# EAGLE design Arm_V4 (EAGLE 9.6.2)
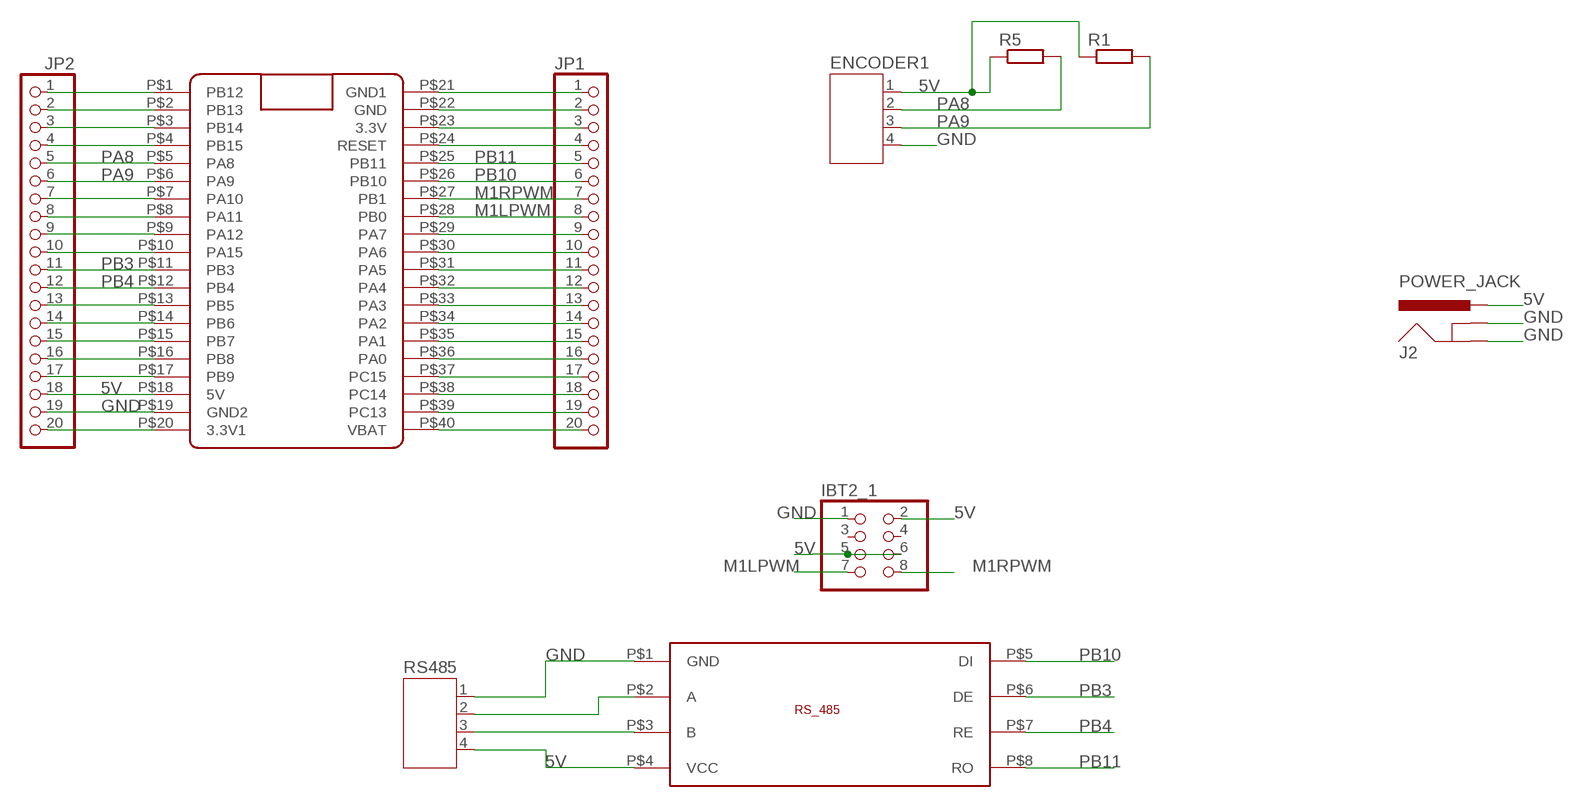
[diagram p0: schematic, sheet 1]

## Parts
ENCODER1  JST-PH4  [JST-PH4]
IBT2_1  PINHD-2X4  [2X04]
J2  POWER_JACK  [POWER_JACK]
JP1  PINHD-1X20  [1X20]
JP2  PINHD-1X20  [1X20]
R1  R-EU_0207/10  [0207/10]
R5  R-EU_0207/10  [0207/10]
RS485  JST-PH4  [JST-PH4]
U$1  BLUE_PILL  [BLUE_PILL]
U$2  RS_485PCB  [RSS485PCB]

## Nets
5V: ENCODER1.1 IBT2_1.2 IBT2_1.5 IBT2_1.6 J2.PWR JP2.18 R1.1 R5.1 RS485.4 U$1.P$18(5V) U$2.P$4(VCC)
GND: ENCODER1.4 IBT2_1.1 J2.GNDBREAK JP2.19 RS485.1 U$1.P$19(GND2) U$2.P$1(GND)
M1LPWM: IBT2_1.7 JP1.8 U$1.P$28(PB0)
M1RPWM: IBT2_1.8 JP1.7 U$1.P$27(PB1)
N$1: JP1.1 U$1.P$21(GND1)
N$2: JP1.2 U$1.P$22(GND)
N$3: JP1.3 U$1.P$23(3.3V)
N$4: JP1.4 U$1.P$24(RESET)
N$5: JP1.9 U$1.P$29(PA7)
N$6: J2.GND
N$7: JP1.10 U$1.P$30(PA6)
N$8: JP2.14 U$1.P$14(PB6)
N$9: JP2.15 U$1.P$15(PB7)
N$10: RS485.2 U$2.P$2(A)
N$11: JP1.11 U$1.P$31(PA5)
N$12: JP1.12 U$1.P$32(PA4)
N$13: JP1.13 U$1.P$33(PA3)
N$14: JP1.14 U$1.P$34(PA2)
N$15: JP1.15 U$1.P$35(PA1)
N$16: JP1.16 U$1.P$36(PA0)
N$17: JP1.17 U$1.P$37(PC15)
N$18: JP1.18 U$1.P$38(PC14)
N$19: JP1.19 U$1.P$39(PC13)
N$20: JP1.20 U$1.P$40(VBAT)
N$21: JP2.1 U$1.P$1(PB12)
N$22: JP2.2 U$1.P$2(PB13)
N$23: JP2.3 U$1.P$3(PB14)
N$24: JP2.4 U$1.P$4(PB15)
N$25: RS485.3 U$2.P$3(B)
N$27: JP2.7 U$1.P$7(PA10)
N$28: JP2.8 U$1.P$8(PA11)
N$29: JP2.9 U$1.P$9(PA12)
N$30: JP2.10 U$1.P$10(PA15)
N$33: JP2.13 U$1.P$13(PB5)
N$36: JP2.16 U$1.P$16(PB8)
N$37: JP2.17 U$1.P$17(PB9)
N$40: JP2.20 U$1.P$20(3.3V1)
PA8: ENCODER1.2 JP2.5 R5.2 U$1.P$5(PA8)
PA9: ENCODER1.3 JP2.6 R1.2 U$1.P$6(PA9)
PB3: JP2.11 U$1.P$11(PB3) U$2.P$6(DE)
PB4: JP2.12 U$1.P$12(PB4) U$2.P$7(RE)
PB10: JP1.6 U$1.P$26(PB10) U$2.P$5(DI)
PB11: JP1.5 U$1.P$25(PB11) U$2.P$8(RO)
Unconnected: IBT2_1.3 IBT2_1.4

## Library data of the parts
ENCODER1 RS485 = jst-ph:JST-PH4
IBT2_1 = pinhead:PINHD-2X4: PIN HEADER
J2 = J-Generic-5.5mm-Barrel-Jack:POWER_JACK: Power Jack Connector This is the standard 5.5mm barrel jack for power. The PTH is the most common, proven, reliable, footprint. The Slot footprint only works if the mill layer is transmitted to the PCB fab house so be warned. Here are the connectors we sell at SparkFun: DC Barrel Power Jack/Connector <https://www.sparkfun.com/products/119> (PRT-00119) DC Barrel Power Jack/Connector (SMD) <https://www.sparkfun.com/products/12748> (PRT-12748) DC Barrel Jack Adapter - Breadboard Compatible <https://www.sparkfun.com/products/10811> (PRT-10811) It is used on this SparkFun product (and many, many others): SparkFun RedBoard - Programmed with Arduino <https://www.sparkfun.com/products/12757> (DEV-12757) Also, if you need a mating power supply or connector, please check these out: Wall Adapter Power Supply - 9VDC 650mA <https://www.sparkfun.com/products/298> (TOL-00298) DC Barrel Jack Adapter - Male <https://www.sparkfun.com/products/10287> (PRT-10287); DPN: CP-202A-ND; MPN: PJ-202A
JP1 JP2 = pinhead:PINHD-1X20: PIN HEADER
R1 R5 = rcl:R-EU_: RESISTOR, European symbol; SPICEPREFIX: R
U$1 = BluePill:BLUE_PILL
U$2 = RS_485PCB:RS_485PCB

## Net classes
0 default: width 1.016 mm, clearance 0.508 mm

## Board
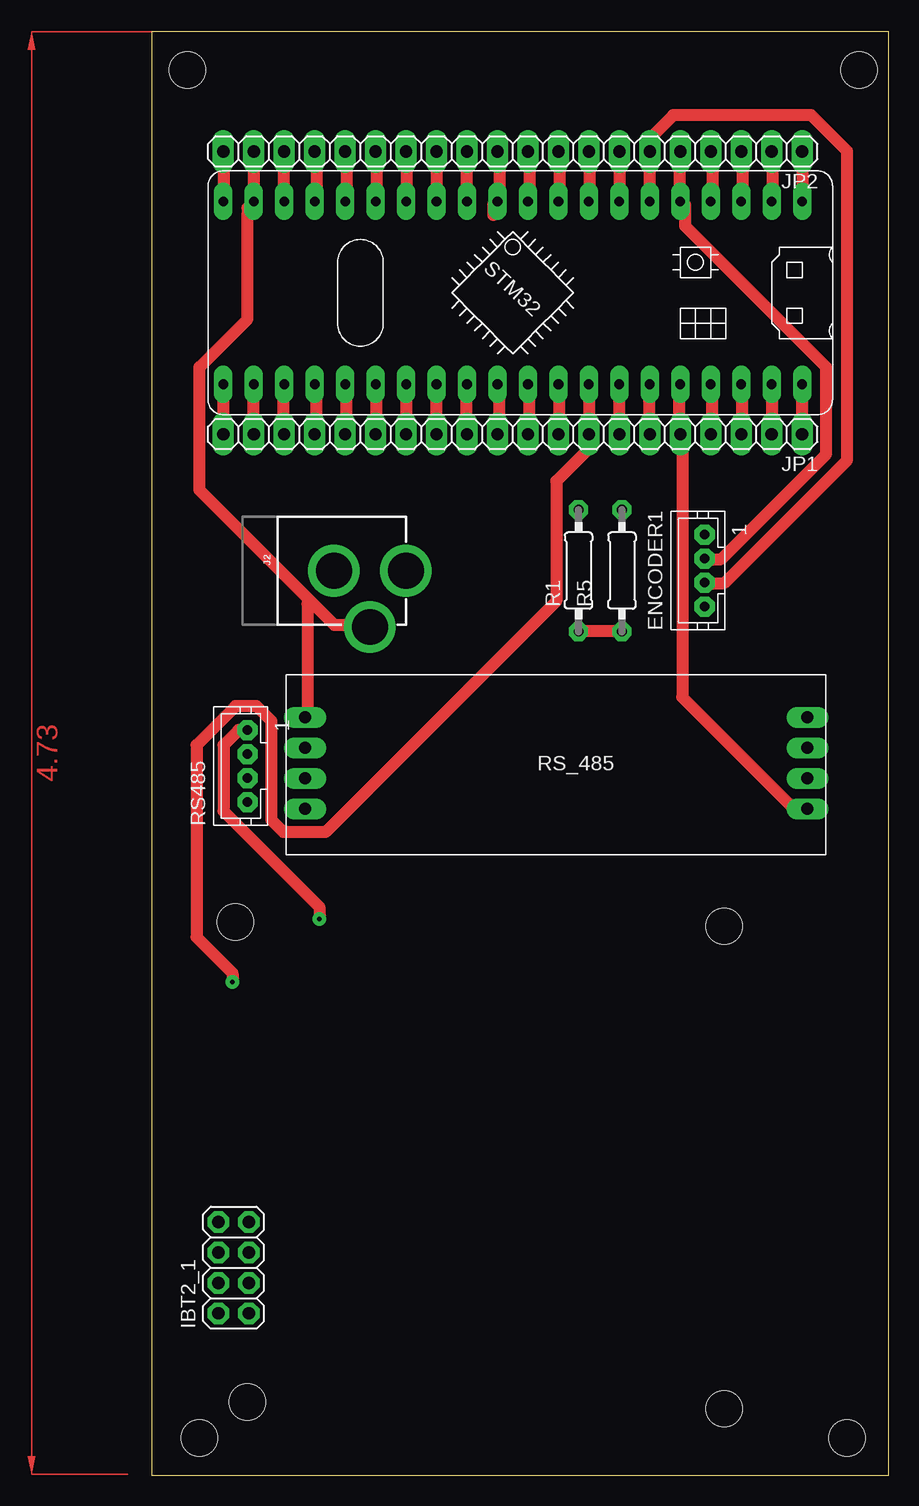
[diagram p1: board, top side]
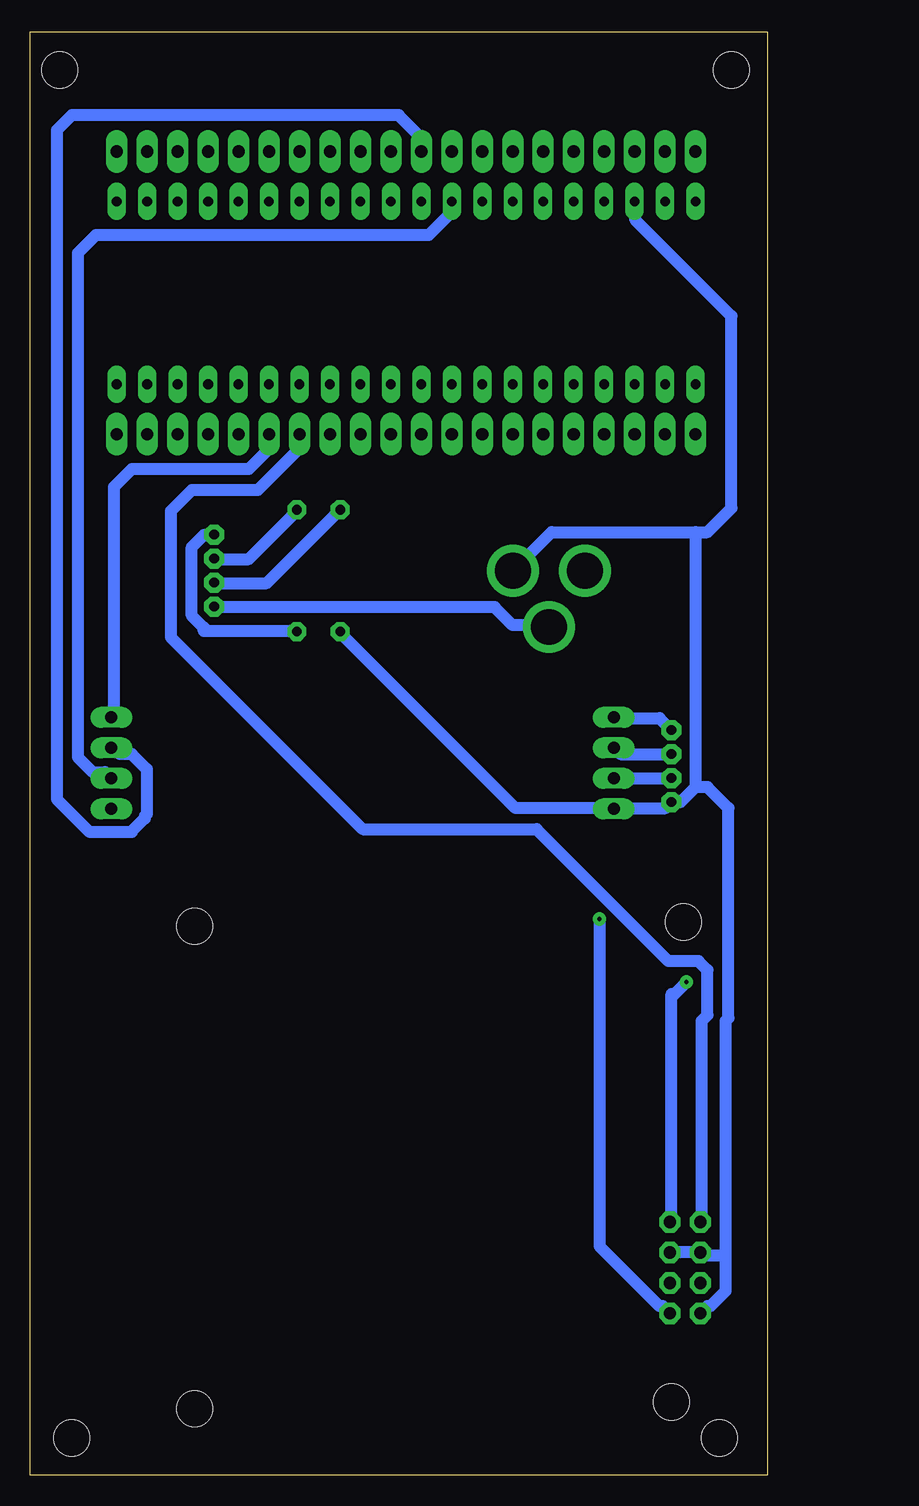
[diagram p2: board, bottom side, seen from below]

Size 61.48 x 120.29 mm. Coordinates in mm from the lower left corner, seen from the top.
Outline: 0,0 61.48,0 61.48,120.29 0,120.29 0,0
Copper layers (1*16): Top 0.035mm / dielectric 1.5mm / Bottom 0.035mm
Design rules "default *": minimum track width 40mil, minimum drill 0.35mm, track to track 20mil, track to pad 6mil, pad to pad 6mil, via to via 6mil, smd to smd 6mil, copper to edge 40mil, drill to drill 6mil, minimum pad ring 15mil, minimum via ring 15mil, stop-mask expansion 4mil, vias tented up to drill 0mil, thermal gap 10mil
Holes 3 mm at 47.75,45.73 47.75,5.53 7,46.08 3,117.08 8,6.08 59,117.08 58,3.08 4,3.08
tRestrict: area 7.5,5.5 to 47.8,45.7; area 4,12.1 to 7,22.1

### Footprints (pad centres in the part's own frame; a part is rotated, then mirrored left to right if it is on the bottom)
JST-PH4 = drill 0.813 pad 1.676 octagon: 1 3,0; 2 1,0; 3 -1,0; 4 -3,0
2X04 = drill 1.016 octagon: 1 -3.81,-1.27; 2 -3.81,1.27; 3 -1.27,-1.27; 4 -1.27,1.27; 5 1.27,-1.27; 6 1.27,1.27; 7 3.81,-1.27; 8 3.81,1.27
POWER_JACK = drill 2.997 pad 4.318: GND 0,7.7; GNDBREAK 4.7,10.7; PWR 0,13.7
1X20 = drill 1.016 long: 1 -24.13,0; 2 -21.59,0; 3 -19.05,0; 4 -16.51,0; 5 -13.97,0; 6 -11.43,0; 7 -8.89,0; 8 -6.35,0; 9 -3.81,0; 10 -1.27,0; 11 1.27,0; 12 3.81,0; 13 6.35,0; 14 8.89,0; 15 11.43,0; 16 13.97,0; 17 16.51,0; 18 19.05,0; 19 21.59,0; 20 24.13,0
0207/10 = drill 0.813 octagon: 1 -5.08,0; 2 5.08,0
BLUE_PILL = drill 0.8 long: P$1 -7.62,15.24; P$2 -7.62,12.7; P$3 -7.62,10.16; P$4 -7.62,7.62; P$5 -7.62,5.08; P$6 -7.62,2.54; P$7 -7.62,0; P$8 -7.62,-2.54; P$9 -7.62,-5.08; P$10 -7.62,-7.62; P$11 -7.62,-10.16; P$12 -7.62,-12.7; P$13 -7.62,-15.24; P$14 -7.62,-17.78; P$15 -7.62,-20.32; P$16 -7.62,-22.86; P$17 -7.62,-25.4; P$18 -7.62,-27.94; P$19 -7.62,-30.48; P$20 -7.62,-33.02; P$21 7.62,15.24; P$22 7.62,12.7; P$23 7.62,10.16; P$24 7.62,7.62; P$25 7.62,5.08; P$26 7.62,2.54; P$27 7.62,0; P$28 7.62,-2.54; P$29 7.62,-5.08; P$30 7.62,-7.62; P$31 7.62,-10.16; P$32 7.62,-12.7; P$33 7.62,-15.24; P$34 7.62,-17.78; P$35 7.62,-20.32; P$36 7.62,-22.86; P$37 7.62,-25.4; P$38 7.62,-27.94; P$39 7.62,-30.48; P$40 7.62,-33.02
RSS485PCB = drill 1 long: P$1 1.57,11.43; P$2 1.57,8.89; P$3 1.57,6.35; P$4 1.57,3.81; P$5 43.45,11.43; P$6 43.45,8.89; P$7 43.45,6.35; P$8 43.45,3.81

### Placement (x,y rotation side)
ENCODER1  46.12,75.37 90 top
IBT2_1  6.85,17.28 90 top
J2  7.51,75.37 270 top
JP1  30.12,86.74 180 top
JP2  30.12,110.3 180 top
R1  35.61,75.37 90 top
R5  39.23,75.37 90 top
RS485  8,59.08 90 top
U$1  39.01,98.52 270 top
U$2  11.24,51.7 0 top

### Tracks (layer width: path | path; a pad name or v marks a point on that pad's centre or on a via)
5V
  Top 1.016: U$1.P$18 11,106.33 11,110.08 JP2.18 | R1.1 35.75,70.33 39,70.33 R5.1
  Bottom 1.016: 11,105.08 11,106.08 U$1.P$18 11,104.58 3,96.58 3,80.58 5,78.58 6,78.58 | ENCODER1.1 46.25,78.33 47,78.33 48,77.33 48,71.63 47,70.63 47,70.33 39.25,70.33 R5.1 | 3.5,18.33 3.5,15.33 4.75,14.08 5,14.08 5.5,13.58 IBT2_1.2 | 3.5,18.33 5.5,18.33 IBT2_1.6 6,18.58 8,18.58 IBT2_1.5 | 6,78.58 18,78.58 J2.PWR | 6,57.33 7.25,56.08 RS485.4 8.5,55.58 12.75,55.58 U$2.P$4 13.25,55.58 21,55.58 35.5,70.08 R1.1 | 6,78.58 6,57.33 | 3.5,18.33 3.5,37.83 3.25,38.08 3.25,55.58 5,57.33 6,57.33
GND  (via drill 0.35)
  Top 1.016: U$1.P$19 8.5,106.33 8.5,110.08 JP2.19 | 8,105.58 8.25,105.83 U$1.P$19 | v14,46.33 14,47.33 6,55.33 6,60.83 7.25,62.08 RS485.1 | 13.25,72.83 15.25,70.83 18,70.83 J2.GNDBREAK | 13.25,72.83 4,82.08 4,92.33 8,96.33 8,105.08 U$1.P$19 | U$2.P$1 13,63.33 13,72.58 13.25,72.83
  Bottom 1.016: RS485.1 9,63.08 12.75,63.08 U$2.P$1 | v14,46.33 14,19.08 9,14.08 8.75,14.08 8.25,13.58 IBT2_1.1 | ENCODER1.4 46,72.33 22.75,72.33 21.25,70.83 18.25,70.83 J2.GNDBREAK
M1LPWM  (via drill 0.35)
  Top 1.016: U$1.P$28 36.5,90.83 36.5,86.83 JP1.8 36.25,86.33 36.25,85.33 33.75,82.83 33.75,72.83 14.5,53.58 11,53.58 10,54.58 10,62.83 8.75,64.08 7,64.08 3.75,60.83 3.75,44.83 6.75,41.83 v6.75,41.08
  Bottom 1.016: 36.5,91.83 36.5,91.08 U$1.P$28 | IBT2_1.7 8,21.33 8,40.08 7.75,40.08 v6.75,41.08
M1RPWM
  Top 1.016: U$1.P$27 39,90.83 39,86.83 JP1.7
  Bottom 1.016: 39,85.58 39,86.58 JP1.7 39.25,85.33 42.5,82.08 48,82.08 49.75,80.33 49.75,69.83 33.75,53.83 19.25,53.83 8.25,42.83 5.75,42.83 5,42.08 5,38.33 5.5,37.83 5.5,21.33 IBT2_1.8
N$1
  Top 1.016: JP1.1 U$1.P$21
N$2
  Top 1.016: U$1.P$22 51.75,90.83 51.75,86.83 JP1.2
N$3
  Top 1.016: U$1.P$23 49.25,90.83 49.25,86.83 JP1.3
N$4
  Top 1.016: U$1.P$24 46.75,90.83 46.75,86.83 JP1.4
N$5
  Top 1.016: U$1.P$29 34,90.83 34,86.83 JP1.9
N$7
  Top 1.016: U$1.P$30 31.5,90.83 31.5,86.83 JP1.10
N$8
  Top 1.016: U$1.P$14 21.25,106.33 21.25,110.08 JP2.14
N$9
  Top 1.016: U$1.P$15 18.75,106.33 18.75,110.08 JP2.15
N$10
  Bottom 1.016: RS485.2 12.25,60.08 12.75,60.58 U$2.P$2
N$11
  Top 1.016: U$1.P$31 29,90.83 29,86.83 JP1.11
N$12
  Top 1.016: U$1.P$32 26.25,90.83 26.25,86.83 JP1.12
N$13
  Top 1.016: U$1.P$33 23.75,90.83 23.75,86.83 JP1.13
N$14
  Top 1.016: U$1.P$34 21.25,90.83 21.25,86.83 JP1.14
N$15
  Top 1.016: U$1.P$35 18.75,90.83 18.75,86.83 JP1.15
N$16
  Top 1.016: U$1.P$36 16.25,90.83 16.25,86.83 JP1.16
N$17
  Top 1.016: U$1.P$37 13.75,90.83 13.75,86.83 JP1.17
N$18
  Top 1.016: U$1.P$38 11,90.83 11,86.83 JP1.18
N$19
  Top 1.016: U$1.P$39 8.5,90.83 8.5,86.83 JP1.19
N$20
  Top 1.016: U$1.P$40 6,90.83 6,86.83 JP1.20
N$21
  Top 1.016: JP2.1 U$1.P$1
N$22
  Top 1.016: U$1.P$2 51.75,106.33 51.75,110.08 JP2.2
N$23
  Top 1.016: U$1.P$3 49.25,106.33 49.25,110.08 JP2.3
N$24
  Top 1.016: U$1.P$4 46.75,106.33 46.75,110.08 JP2.4
N$25
  Bottom 1.016: RS485.3 12.75,58.08 U$2.P$3
N$27
  Top 1.016: U$1.P$7 39,106.33 39,110.08 JP2.7
N$28
  Top 1.016: U$1.P$8 36.5,106.33 36.5,110.08 JP2.8
N$29
  Top 1.016: U$1.P$9 34,106.33 34,110.08 JP2.9
N$30
  Top 1.016: U$1.P$10 31.5,106.33 31.5,110.08 JP2.10
N$33
  Top 1.016: U$1.P$13 23.75,106.33 23.75,110.08 JP2.13
N$36
  Top 1.016: U$1.P$16 16.25,106.33 16.25,110.08 JP2.16
N$37
  Top 1.016: U$1.P$17 13.75,106.33 13.75,110.08 JP2.17
N$40
  Top 1.016: U$1.P$20 6,106.33 6,110.08 JP2.20
PA8
  Top 1.016: JP2.5 44,110.08 44,106.33 U$1.P$5 44.5,105.83 44.5,104.08 56.25,92.33 56.25,85.08 47.5,76.33 46.25,76.33 ENCODER1.2
  Bottom 1.016: 44,105.08 44,106.08 U$1.P$5 | R5.2 39.25,80.33 43.25,76.33 46,76.33 ENCODER1.2
PA9
  Top 1.016: U$1.P$6 41.5,106.33 41.5,110.08 JP2.6 41.5,110.83 41.5,111.33 43.5,113.33 55,113.33 58,110.33 58,84.58 47.75,74.33 46.25,74.33 ENCODER1.3
  Bottom 1.016: 41.5,105.08 41.5,106.08 U$1.P$6 | R1.2 35.75,80.33 41.75,74.33 46,74.33 ENCODER1.3
PB3
  Top 1.016: JP2.11 29,110.08 29,106.33 U$1.P$11 28.5,105.83 28.5,105.01
  Bottom 1.016: U$2.P$6 54.5,60.58 54,60.08 53,60.08 51.75,58.83 51.75,55.08 51.91,54.92 51.91,54.72 53,53.64 53,53.58 56.5,53.58 59.25,56.33 59.25,112.08 58,113.33 30.75,113.33 29,111.58 29,110.33 JP2.11
PB4
  Top 1.016: U$1.P$12 26.25,106.33 26.25,110.08 JP2.12 26.25,110.83
  Bottom 1.016: U$2.P$7 54.75,58.08 55.25,58.58 56.25,58.58 57.5,59.83 57.5,101.83 56,103.33 28.25,103.33 26.5,105.08 26.5,106.08 U$1.P$12
PB10
  Top 1.016: U$1.P$26 41.5,90.83 41.5,86.83 JP1.6
  Bottom 1.016: 41.5,85.58 41.5,86.58 JP1.6 41.75,85.33 43.25,83.83 53,83.83 54.5,82.33 54.5,63.33 U$2.P$5
PB11
  Top 1.016: U$1.P$25 44,90.83 44,86.83 JP1.5 44.25,86.33 44.25,64.83 53.5,55.58 54.5,55.58 U$2.P$8
  Bottom 1.016: 44,85.58 44,86.58 JP1.5
(copper drawn outside any net)
  shapes: Top area x2

### Text on the board
tDocu: ARM | Shafayet Sadik Sowad | Fabbiha Bushra | Safwan Sami | Sadi Mobassir